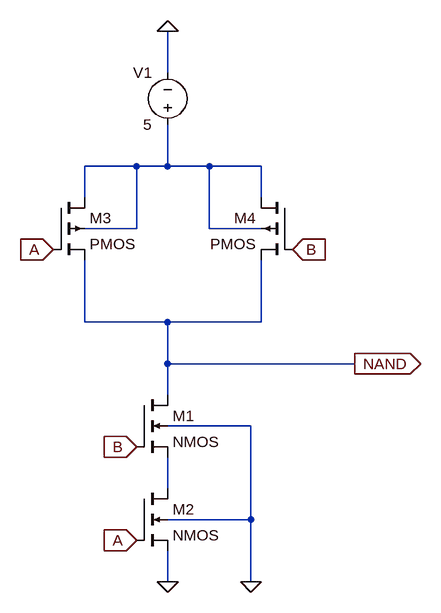
[diagram p0: schematic NAND.asc]
NAND.asc, the LTspice schematic file:
Version 4
SHEET 1 880 680
WIRE 224 -368 224 -432
WIRE 176 -224 96 -224
WIRE 224 -224 224 -288
WIRE 224 -224 176 -224
WIRE 288 -224 224 -224
WIRE 368 -224 288 -224
WIRE 96 -176 96 -224
WIRE 368 -176 368 -224
WIRE 176 -128 176 -224
WIRE 176 -128 96 -128
WIRE 288 -128 288 -224
WIRE 368 -128 288 -128
WIRE 96 16 96 -80
WIRE 224 16 96 16
WIRE 368 16 368 -80
WIRE 368 16 224 16
WIRE 224 80 224 16
WIRE 512 80 224 80
WIRE 224 128 224 80
WIRE 352 176 224 176
WIRE 224 272 224 224
WIRE 352 320 352 176
WIRE 352 320 224 320
WIRE 224 416 224 368
WIRE 352 416 352 320
FLAG 352 416 0
FLAG 224 416 0
FLAG 176 352 A
IOPIN 176 352 In
FLAG 48 -96 A
IOPIN 48 -96 In
FLAG 416 -96 B
IOPIN 416 -96 In
FLAG 176 208 B
IOPIN 176 208 In
FLAG 224 -432 0
FLAG 512 80 NAND
IOPIN 512 80 Out
SYMBOL nmos4 176 128 R0
SYMATTR InstName M1
SYMBOL nmos4 176 272 R0
SYMATTR InstName M2
SYMBOL pmos4 48 -176 R0
SYMATTR InstName M3
SYMBOL pmos4 416 -176 M0
SYMATTR InstName M4
SYMBOL voltage 224 -272 R180
WINDOW 0 24 96 Left 2
WINDOW 3 24 16 Left 2
SYMATTR InstName V1
SYMATTR Value 5

The netlist it stands for:
* NAND.asc
M1 NAND B N002 0 NMOS
M2 N002 A 0 0 NMOS
M3 N001 A NAND N001 PMOS
M4 N001 B NAND N001 PMOS
V1 N001 0 5
.model NMOS NMOS
.model PMOS PMOS
.lib standard.mos
.backanno
.end